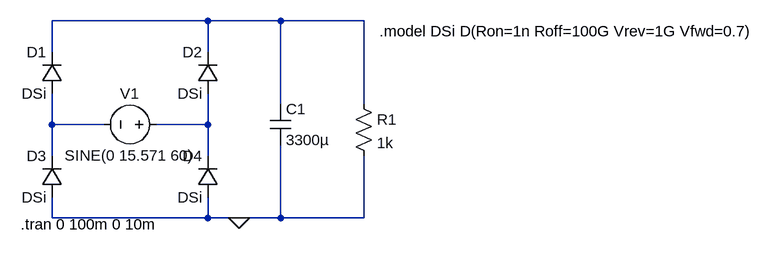
[diagram p0: schematic LucasSantosdeLuccaExercicio20.asc]
LucasSantosdeLuccaExercicio20.asc, the LTspice schematic file:
Version 4
SHEET 1 1180 680
WIRE 288 32 48 32
WIRE 400 32 288 32
WIRE 528 32 400 32
WIRE 48 80 48 32
WIRE 288 80 288 32
WIRE 400 160 400 32
WIRE 528 160 528 32
WIRE 48 192 48 144
WIRE 128 192 48 192
WIRE 288 192 288 144
WIRE 288 192 208 192
WIRE 48 240 48 192
WIRE 288 240 288 192
WIRE 48 336 48 304
WIRE 288 336 288 304
WIRE 288 336 48 336
WIRE 336 336 288 336
WIRE 400 336 400 224
WIRE 400 336 336 336
WIRE 528 336 528 240
WIRE 528 336 400 336
FLAG 336 336 0
SYMBOL diode 64 144 R180
WINDOW 0 24 64 Left 2
WINDOW 3 24 0 Left 2
SYMATTR InstName D1
SYMATTR Value DSi
SYMBOL diode 304 144 R180
WINDOW 0 24 64 Left 2
WINDOW 3 24 0 Left 2
SYMATTR InstName D2
SYMATTR Value DSi
SYMBOL diode 304 304 R180
WINDOW 0 24 64 Left 2
WINDOW 3 24 0 Left 2
SYMATTR InstName D4
SYMATTR Value DSi
SYMBOL diode 64 304 R180
WINDOW 0 24 64 Left 2
WINDOW 3 24 0 Left 2
SYMATTR InstName D3
SYMATTR Value DSi
SYMBOL voltage 224 192 R90
WINDOW 0 -32 56 VBottom 2
WINDOW 3 32 56 VTop 2
WINDOW 123 0 0 Left 0
WINDOW 39 0 0 Left 0
SYMATTR InstName V1
SYMATTR Value SINE(0 15.571 60)
SYMBOL cap 384 160 R0
SYMATTR InstName C1
SYMATTR Value 3300µ
SYMBOL res 512 144 R0
SYMATTR InstName R1
SYMATTR Value 1k
TEXT 552 48 Left 2 !.model DSi D(Ron=1n Roff=100G Vrev=1G Vfwd=0.7)
TEXT 0 346 Left 2 !.tran 0 100m 0 10m

The netlist it stands for:
* LucasSantosdeLuccaExercicio20.asc
D1 N002 N001 DSi
D2 N003 N001 DSi
D4 0 N003 DSi
D3 0 N002 DSi
V1 N003 N002 SINE(0 15.571 60)
C1 N001 0 3300µ
R1 N001 0 1k
.model D D
.lib standard.dio
.model DSi D(Ron=1n Roff=100G Vrev=1G Vfwd=0.7)
.tran 0 100m 0 10m
.backanno
.end